# Altium schematic sheet CHM_CPU_FPGA_Peripherals.SchDoc: CHOMIK CPU Module
size A3; Author: Andrzej Cichocki; Organization: Space Research Centre; Address1: Bartycka 18a; Address2: 00-716 Warsaw; Address3: Poland; Revision: 1; ModuleName: FPGA IP-Core: Processor's Peripherals; SubOrganization1: FPGA Space Applications Lab.
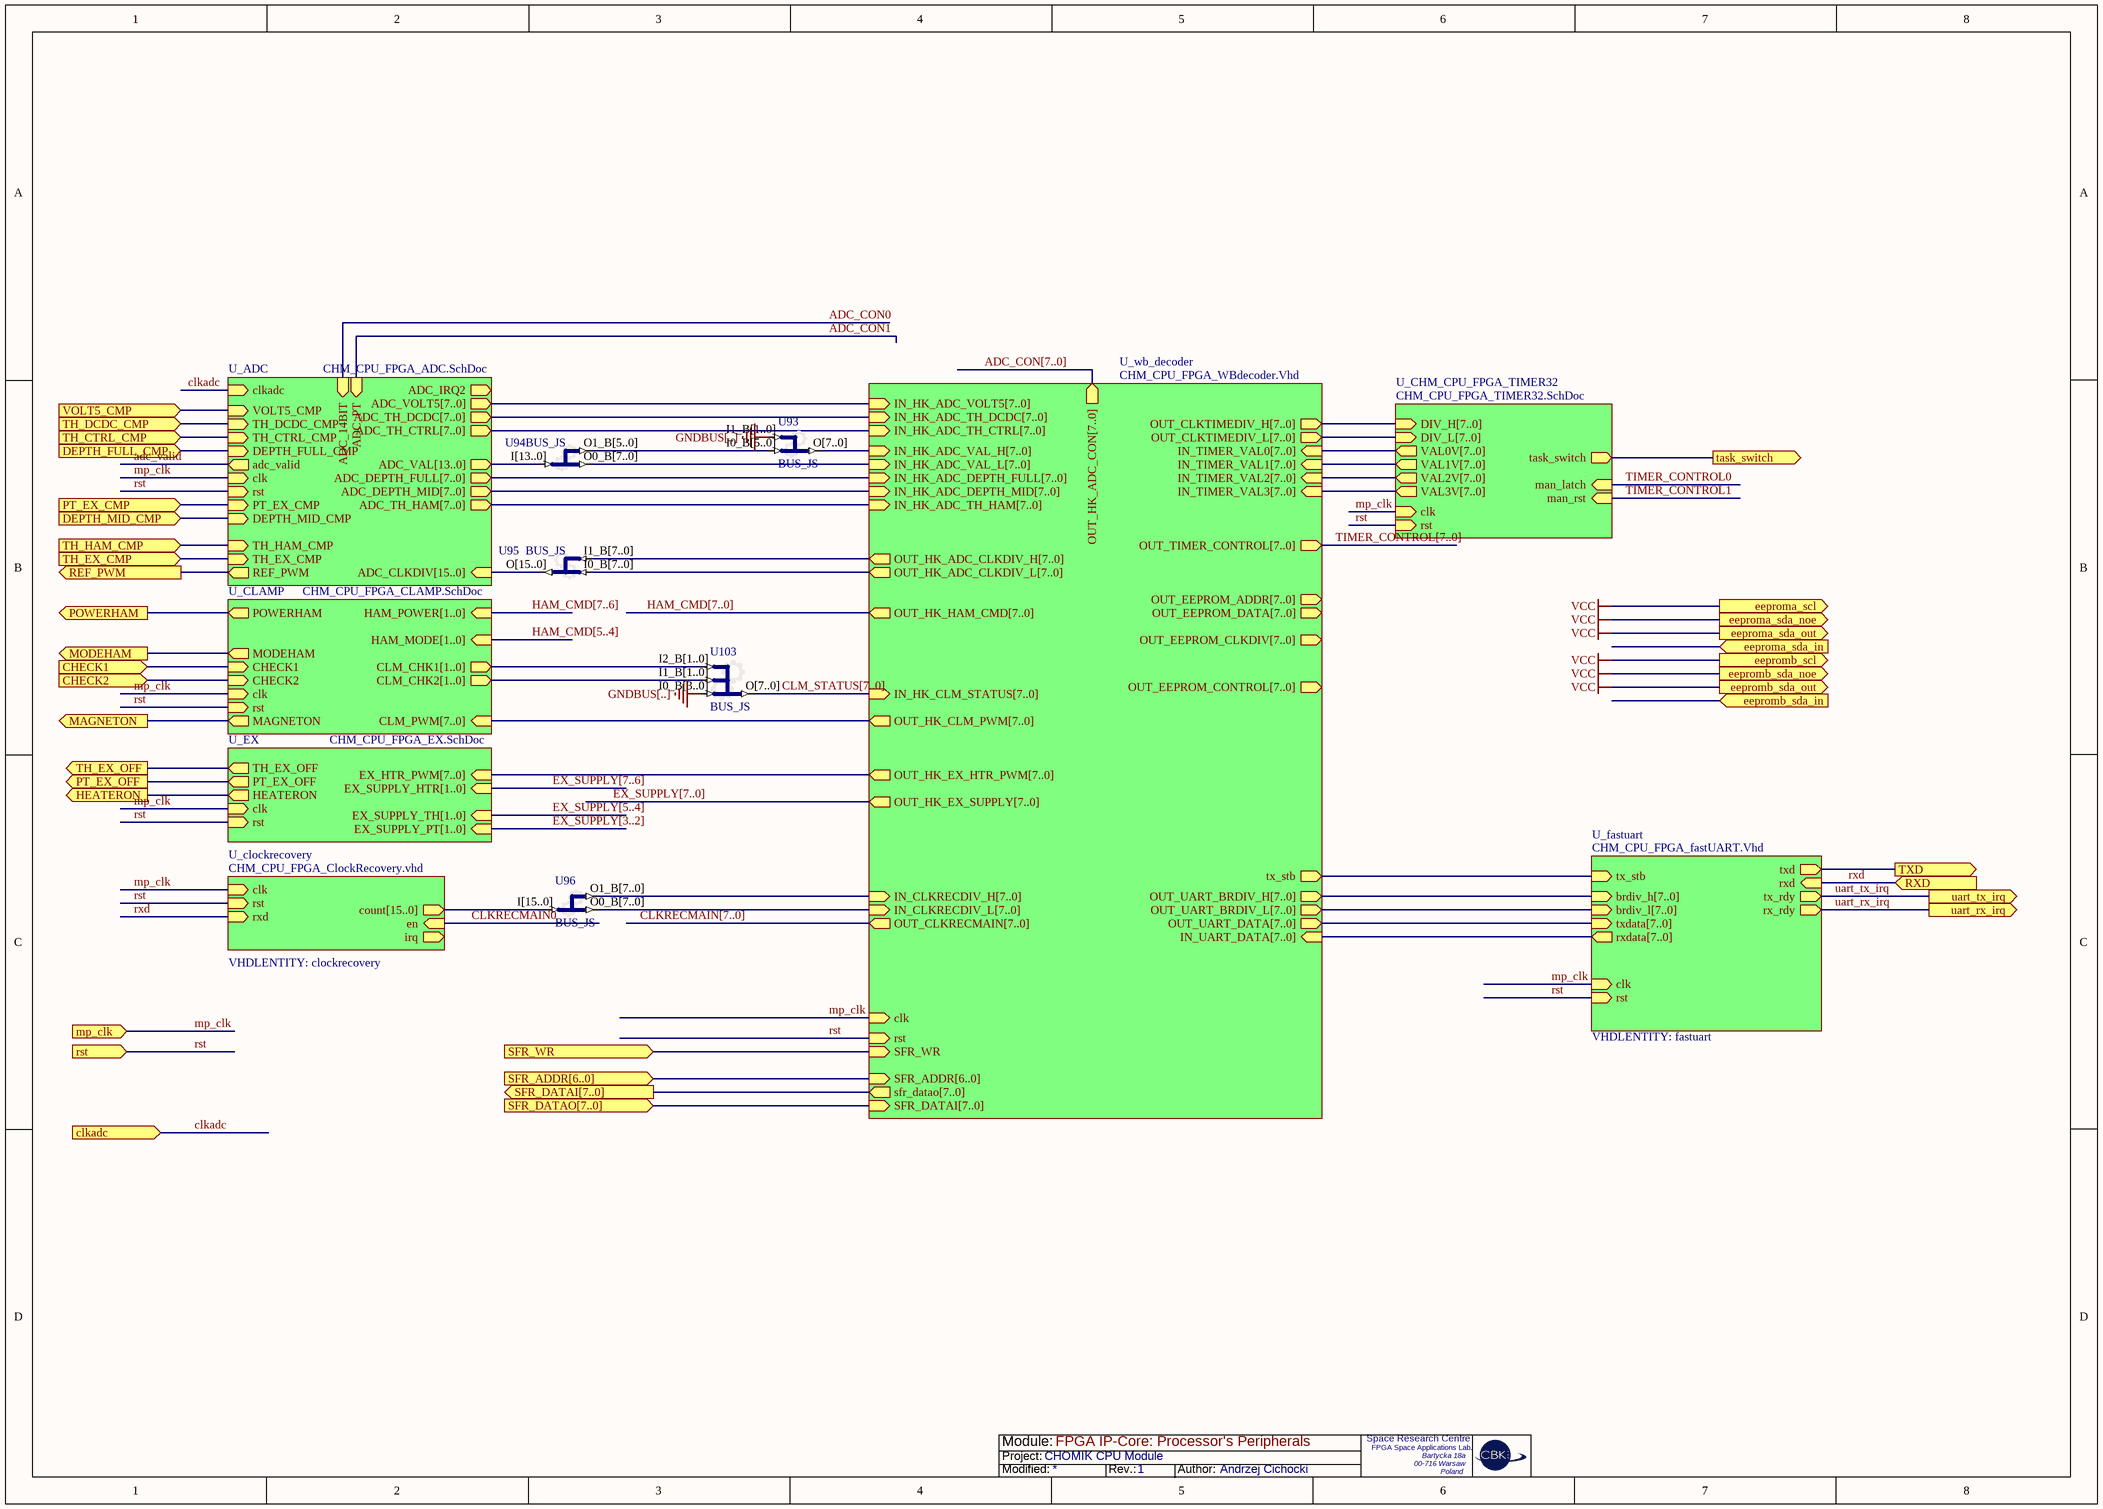
[diagram p0: CHM_CPU_FPGA_Peripherals.SchDoc]

## Parts
U93  BUS_JS
U94  BUS_JS
U95  BUS_JS
U96  BUS_JS
U103  BUS_JS

## Sub-sheets
U_ADC = CHM_CPU_FPGA_ADC.SchDoc: ADC_VOLT5[7..0] (out), ADC_TH_DCDC[7..0] (out), ADC_TH_CTRL[7..0] (out), ADC_DEPTH_FULL[7..0] (out), ADC_DEPTH_MID[7..0] (out), ADC_TH_HAM[7..0] (out), ADC_CLKDIV[15..0] (in), REF_PWM (out), VOLT5_CMP (in), TH_DCDC_CMP (in), TH_CTRL_CMP (in), TH_EX_CMP (in), DEPTH_FULL_CMP (in), DEPTH_MID_CMP (in), TH_HAM_CMP (in), PT_EX_CMP (in), adc_valid (out), clk (in), rst (in), ADC_14BIT (in), ADC_PT (in), ADC_VAL[13..0] (out), ADC_IRQ2 (out), clkadc (in)
U_CHM_CPU_FPGA_TIMER32 = CHM_CPU_FPGA_TIMER32.SchDoc: task_switch (out), clk (in), rst (in), DIV_L[7..0] (in), DIV_H[7..0] (in), VAL0V[7..0] (out), VAL1V[7..0] (out), VAL2V[7..0] (out), VAL3V[7..0] (out), man_rst (in), man_latch (in)
U_CLAMP = CHM_CPU_FPGA_CLAMP.SchDoc: CLM_PWM[7..0] (in), CLM_CHK1[1..0] (out), HAM_MODE[1..0] (in), HAM_POWER[1..0] (in), POWERHAM (out), MODEHAM (out), CHECK1 (in), CHECK2 (in), MAGNETON (out), CLM_CHK2[1..0] (out), clk (in), rst (in)
U_clockrecovery = CHM_CPU_FPGA_ClockRecovery.vhd: clk (in), count[15..0] (out), en (in), irq (out), rst (in), rxd (in)  | VHDLENTITY: clockrecovery
U_EX = CHM_CPU_FPGA_EX.SchDoc: EX_HTR_PWM[7..0] (in), EX_SUPPLY_HTR[1..0] (in), EX_SUPPLY_TH[1..0] (in), EX_SUPPLY_PT[1..0] (in), TH_EX_OFF (out), PT_EX_OFF (out), HEATERON (out), clk (in), rst (in)
U_fastuart = CHM_CPU_FPGA_fastUART.Vhd: rx_rdy (out), rxd (in), tx_rdy (out), txd (out), tx_stb (in), brdiv_h[7..0] (in), brdiv_l[7..0] (in), txdata[7..0] (in), rxdata[7..0] (out), clk (in), rst (in)  | VHDLENTITY: fastuart
U_wb_decoder = CHM_CPU_FPGA_WBdecoder.Vhd: SFR_ADDR[6..0] (in), SFR_WR (in), clk (in), rst (in), SFR_DATAI[7..0] (in), OUT_UART_DATA[7..0] (out), OUT_UART_BRDIV_H[7..0] (out), OUT_EEPROM_ADDR[7..0] (out), OUT_EEPROM_DATA[7..0] (out), OUT_EEPROM_CONTROL[7..0] (out), OUT_EEPROM_CLKDIV[7..0] (out), OUT_HK_ADC_CLKDIV_H[7..0] (out), OUT_HK_ADC_CLKDIV_L[7..0] (out), OUT_HK_HAM_CMD[7..0] (out), OUT_HK_CLM_PWM[7..0] (out), OUT_HK_EX_HTR_PWM[7..0] (out), OUT_HK_EX_SUPPLY[7..0] (out), IN_HK_ADC_VOLT5[7..0] (in), IN_HK_ADC_TH_DCDC[7..0] (in), IN_HK_ADC_TH_CTRL[7..0] (in), IN_HK_ADC_VAL_H[7..0] (in), IN_HK_ADC_VAL_L[7..0] (in), IN_HK_ADC_DEPTH_FULL[7..0] (in), IN_HK_ADC_DEPTH_MID[7..0] (in), IN_HK_ADC_TH_HAM[7..0] (in), IN_HK_CLM_STATUS[7..0] (in), OUT_HK_ADC_CON[7..0] (out), OUT_TIMER_CONTROL[7..0] (out), IN_TIMER_VAL3[7..0] (in), IN_TIMER_VAL2[7..0] (in), IN_TIMER_VAL1[7..0] (in), IN_TIMER_VAL0[7..0] (in), OUT_CLKRECMAIN[7..0] (out), OUT_CLKTIMEDIV_H[7..0] (out), OUT_CLKTIMEDIV_L[7..0] (out), IN_CLKRECDIV_H[7..0] (in), IN_CLKRECDIV_L[7..0] (in), sfr_datao[7..0] (out), IN_UART_DATA[7..0] (in), OUT_UART_BRDIV_L[7..0] (out), tx_stb (out)  | VHDLENTITY: wb_decoder

## Ports
CHECK1 (in), CHECK2 (in), clkadc (in), DEPTH_FULL_CMP (in), DEPTH_MID_CMP (in), eeproma_scl (out), eeproma_sda_in (in), eeproma_sda_noe (out), eeproma_sda_out (out), eepromb_scl (out), eepromb_sda_in (in), eepromb_sda_noe (out), eepromb_sda_out (out), HEATERON (out), MAGNETON (out), MODEHAM (out), mp_clk (in), POWERHAM (out), PT_EX_CMP (in), PT_EX_OFF (out), REF_PWM (out), rst (in), RXD (in), SFR_ADDR[6..0] (in), SFR_DATAI[7..0] (out), SFR_DATAO[7..0] (in), SFR_WR (in), task_switch (out), TH_CTRL_CMP (in), TH_DCDC_CMP (in), TH_EX_CMP (in), TH_EX_OFF (out), TH_HAM_CMP (in), TXD (out), uart_rx_irq (out), uart_tx_irq (out), VOLT5_CMP (in)

## Nets
GNDBUS[..]: U93.I1_B[1..0] U103.I0_B[3..0]
VCC: port eeproma_scl, port eeproma_sda_noe, port eeproma_sda_out, port eepromb_scl, port eepromb_sda_noe, port eepromb_sda_out
ADC_CON0: sheet U_ADC/ADC_14BIT
ADC_CON1: sheet U_ADC/ADC_PT
adc_valid: sheet U_ADC/adc_valid
CHECK1: port CHECK1, sheet U_CLAMP/CHECK1
CHECK2: port CHECK2, sheet U_CLAMP/CHECK2
clkadc: port clkadc, sheet U_ADC/clkadc
CLKRECMAIN0: sheet U_clockrecovery/en
CLM_STATUS[7..0]: U103.O[7..0] ; sheet U_wb_decoder/IN_HK_CLM_STATUS[7..0]
DEPTH_FULL_CMP: port DEPTH_FULL_CMP, sheet U_ADC/DEPTH_FULL_CMP
DEPTH_MID_CMP: port DEPTH_MID_CMP, sheet U_ADC/DEPTH_MID_CMP
HEATERON: port HEATERON, sheet U_EX/HEATERON
MAGNETON: port MAGNETON, sheet U_CLAMP/MAGNETON
MODEHAM: port MODEHAM, sheet U_CLAMP/MODEHAM
mp_clk: port mp_clk, sheet U_ADC/clk, sheet U_CLAMP/clk, sheet U_EX/clk, sheet U_wb_decoder/clk, sheet U_CHM_CPU_FPGA_TIMER32/clk, sheet U_clockrecovery/clk, sheet U_fastuart/clk
POWERHAM: port POWERHAM, sheet U_CLAMP/POWERHAM
PT_EX_CMP: port PT_EX_CMP, sheet U_ADC/PT_EX_CMP
PT_EX_OFF: port PT_EX_OFF, sheet U_EX/PT_EX_OFF
REF_PWM: port REF_PWM, sheet U_ADC/REF_PWM
rst: port rst, sheet U_ADC/rst, sheet U_CLAMP/rst, sheet U_EX/rst, sheet U_wb_decoder/rst, sheet U_CHM_CPU_FPGA_TIMER32/rst, sheet U_clockrecovery/rst, sheet U_fastuart/rst
rxd: port RXD, sheet U_clockrecovery/rxd, sheet U_fastuart/rxd
SFR_WR: port SFR_WR, sheet U_wb_decoder/SFR_WR
task_switch: port task_switch, sheet U_CHM_CPU_FPGA_TIMER32/task_switch
TH_CTRL_CMP: port TH_CTRL_CMP, sheet U_ADC/TH_CTRL_CMP
TH_DCDC_CMP: port TH_DCDC_CMP, sheet U_ADC/TH_DCDC_CMP
TH_EX_CMP: port TH_EX_CMP, sheet U_ADC/TH_EX_CMP
TH_EX_OFF: port TH_EX_OFF, sheet U_EX/TH_EX_OFF
TH_HAM_CMP: port TH_HAM_CMP, sheet U_ADC/TH_HAM_CMP
TIMER_CONTROL0: sheet U_CHM_CPU_FPGA_TIMER32/man_latch
TIMER_CONTROL1: sheet U_CHM_CPU_FPGA_TIMER32/man_rst
TXD: port TXD, sheet U_fastuart/txd
uart_rx_irq: port uart_rx_irq, sheet U_fastuart/rx_rdy
uart_tx_irq: port uart_tx_irq, sheet U_fastuart/tx_rdy
VOLT5_CMP: port VOLT5_CMP, sheet U_ADC/VOLT5_CMP
NetU93_I0_B[5..0]: U93.I0_B[5..0] U94.O1_B[5..0]
NetU93_O[7..0]: U93.O[7..0] ; sheet U_wb_decoder/IN_HK_ADC_VAL_H[7..0]
NetU94_I[13..0]: U94.I[13..0] ; sheet U_ADC/ADC_VAL[13..0]
NetU94_O0_B[7..0]: U94.O0_B[7..0] ; sheet U_wb_decoder/IN_HK_ADC_VAL_L[7..0]
NetU95_I0_B[7..0]: U95.I0_B[7..0] ; sheet U_wb_decoder/OUT_HK_ADC_CLKDIV_L[7..0]
NetU95_I1_B[7..0]: U95.I1_B[7..0] ; sheet U_wb_decoder/OUT_HK_ADC_CLKDIV_H[7..0]
NetU95_O[15..0]: U95.O[15..0] ; sheet U_ADC/ADC_CLKDIV[15..0]
NetU96_I[15..0]: U96.I[15..0] ; sheet U_clockrecovery/count[15..0]
NetU96_O0_B[7..0]: U96.O0_B[7..0] ; sheet U_wb_decoder/IN_CLKRECDIV_L[7..0]
NetU96_O1_B[7..0]: U96.O1_B[7..0] ; sheet U_wb_decoder/IN_CLKRECDIV_H[7..0]
NetU103_I1_B[1..0]: U103.I1_B[1..0] ; sheet U_CLAMP/CLM_CHK2[1..0]
NetU103_I2_B[1..0]: U103.I2_B[1..0] ; sheet U_CLAMP/CLM_CHK1[1..0]
(unnamed): sheet U_wb_decoder/tx_stb, sheet U_fastuart/tx_stb

## Buses and harness runs
bus ADC_CON[7..0] = sheet U_wb_decoder/OUT_HK_ADC_CON[7..0]
bus CLKRECMAIN[7..0] = sheet U_wb_decoder/OUT_CLKRECMAIN[7..0]
bus CLM_STATUS[7..0] = sheet U_wb_decoder/IN_HK_CLM_STATUS[7..0]
bus EX_SUPPLY[3..2] = sheet U_EX/EX_SUPPLY_PT[1..0]
bus EX_SUPPLY[5..4] = sheet U_EX/EX_SUPPLY_TH[1..0]
bus EX_SUPPLY[7..0] = sheet U_wb_decoder/OUT_HK_EX_SUPPLY[7..0]
bus EX_SUPPLY[7..6] = sheet U_EX/EX_SUPPLY_HTR[1..0]
bus HAM_CMD[5..4] = sheet U_CLAMP/HAM_MODE[1..0]
bus HAM_CMD[7..0] = sheet U_wb_decoder/OUT_HK_HAM_CMD[7..0]
bus HAM_CMD[7..6] = sheet U_CLAMP/HAM_POWER[1..0]
bus port SFR_ADDR[6..0] = sheet U_wb_decoder/SFR_ADDR[6..0]
bus port SFR_DATAI[7..0] = sheet U_wb_decoder/sfr_datao[7..0]
bus port SFR_DATAO[7..0] = sheet U_wb_decoder/SFR_DATAI[7..0]
bus sheet U_ADC/ADC_DEPTH_FULL[7..0] = sheet U_wb_decoder/IN_HK_ADC_DEPTH_FULL[7..0]
bus sheet U_ADC/ADC_DEPTH_MID[7..0] = sheet U_wb_decoder/IN_HK_ADC_DEPTH_MID[7..0]
bus sheet U_ADC/ADC_TH_CTRL[7..0] = sheet U_wb_decoder/IN_HK_ADC_TH_CTRL[7..0]
bus sheet U_ADC/ADC_TH_DCDC[7..0] = sheet U_wb_decoder/IN_HK_ADC_TH_DCDC[7..0]
bus sheet U_ADC/ADC_TH_HAM[7..0] = sheet U_wb_decoder/IN_HK_ADC_TH_HAM[7..0]
bus sheet U_ADC/ADC_VOLT5[7..0] = sheet U_wb_decoder/IN_HK_ADC_VOLT5[7..0]
bus sheet U_CHM_CPU_FPGA_TIMER32/DIV_H[7..0] = sheet U_wb_decoder/OUT_CLKTIMEDIV_H[7..0]
bus sheet U_CHM_CPU_FPGA_TIMER32/DIV_L[7..0] = sheet U_wb_decoder/OUT_CLKTIMEDIV_L[7..0]
bus sheet U_CHM_CPU_FPGA_TIMER32/VAL0V[7..0] = sheet U_wb_decoder/IN_TIMER_VAL0[7..0]
bus sheet U_CHM_CPU_FPGA_TIMER32/VAL1V[7..0] = sheet U_wb_decoder/IN_TIMER_VAL1[7..0]
bus sheet U_CHM_CPU_FPGA_TIMER32/VAL2V[7..0] = sheet U_wb_decoder/IN_TIMER_VAL2[7..0]
bus sheet U_CHM_CPU_FPGA_TIMER32/VAL3V[7..0] = sheet U_wb_decoder/IN_TIMER_VAL3[7..0]
bus sheet U_CLAMP/CLM_PWM[7..0] = sheet U_wb_decoder/OUT_HK_CLM_PWM[7..0]
bus sheet U_EX/EX_HTR_PWM[7..0] = sheet U_wb_decoder/OUT_HK_EX_HTR_PWM[7..0]
bus sheet U_fastuart/brdiv_h[7..0] = sheet U_wb_decoder/OUT_UART_BRDIV_H[7..0]
bus sheet U_fastuart/brdiv_l[7..0] = sheet U_wb_decoder/OUT_UART_BRDIV_L[7..0]
bus sheet U_fastuart/rxdata[7..0] = sheet U_wb_decoder/IN_UART_DATA[7..0]
bus sheet U_fastuart/txdata[7..0] = sheet U_wb_decoder/OUT_UART_DATA[7..0]
bus TIMER_CONTROL[7..0] = sheet U_wb_decoder/OUT_TIMER_CONTROL[7..0]

## Notes on the sheet
- Module:
- Project:
- Modified:
- Rev.:
- Author:

## Library data of the parts
U93 = BUS_JS: Configurable Bus Joiner/Splitter; ConfiguratorName: GENERIC_BUS_JS; ConfigurationParameters: {}Version[1.1]{}SplitterJoinerType[Joiner]{}SignalCount[2]{}SignalWidth0[6]{}GapBelow0[1000000]{}ConnectionType0[Pin]{}SignalWidth1[2]{}GapBelow1[1000000]{}ConnectionType1[Pin]{}ShowPinNames[True]{}; LastRevisionNo: 1.00.00; Published: 17-Sep-2008; Publisher: Altium Limited; HelpURL: https://wiki.altium.com/display/ADOH/Configurable+Generic+Library
U94 = BUS_JS: Configurable Bus Joiner/Splitter; ConfiguratorName: GENERIC_BUS_JS; ConfigurationParameters: {}Version[1.1]{}SplitterJoinerType[Splitter]{}SignalCount[2]{}SignalWidth0[8]{}GapBelow0[1000000]{}ConnectionType0[Pin]{}SignalWidth1[6]{}GapBelow1[1000000]{}ConnectionType1[Pin]{}ShowPinNames[True]{}; LastRevisionNo: 1.00.00; Published: 17-Sep-2008; Publisher: Altium Limited; HelpURL: https://wiki.altium.com/display/ADOH/Configurable+Generic+Library
U95 = BUS_JS: Configurable Bus Joiner/Splitter; ConfiguratorName: GENERIC_BUS_JS; ConfigurationParameters: {}Version[1.1]{}SplitterJoinerType[Joiner]{}SignalCount[2]{}SignalWidth0[8]{}GapBelow0[1000000]{}ConnectionType0[Pin]{}SignalWidth1[8]{}GapBelow1[1000000]{}ConnectionType1[Pin]{}ShowPinNames[True]{}; LastRevisionNo: 1.00.00; Published: 17-Sep-2008; Publisher: Altium Limited; HelpURL: https://wiki.altium.com/display/ADOH/Configurable+Generic+Library
U96 = BUS_JS: Configurable Bus Joiner/Splitter; ConfiguratorName: GENERIC_BUS_JS; ConfigurationParameters: {}Version[1.1]{}SplitterJoinerType[Splitter]{}SignalCount[2]{}SignalWidth0[8]{}GapBelow0[1000000]{}ConnectionType0[Pin]{}SignalWidth1[8]{}GapBelow1[1000000]{}ConnectionType1[Pin]{}ShowPinNames[True]{}; LastRevisionNo: 1.00.00; Published: 17-Sep-2008; Publisher: Altium Limited; HelpURL: https://wiki.altium.com/display/ADOH/Configurable+Generic+Library
U103 = BUS_JS: Configurable Bus Joiner/Splitter; ConfiguratorName: GENERIC_BUS_JS; ConfigurationParameters: {}Version[1.1]{}SplitterJoinerType[Joiner]{}SignalCount[3]{}SignalWidth0[4]{}GapBelow0[1000000]{}ConnectionType0[Pin]{}SignalWidth1[2]{}GapBelow1[1000000]{}ConnectionType1[Pin]{}SignalWidth2[2]{}GapBelow2[1000000]{}ConnectionType2[Pin]{}ShowPinNames[True]{}; LastRevisionNo: 1.00.00; Published: 17-Sep-2008; Publisher: Altium Limited; HelpURL: https://wiki.altium.com/display/ADOH/Configurable+Generic+Library